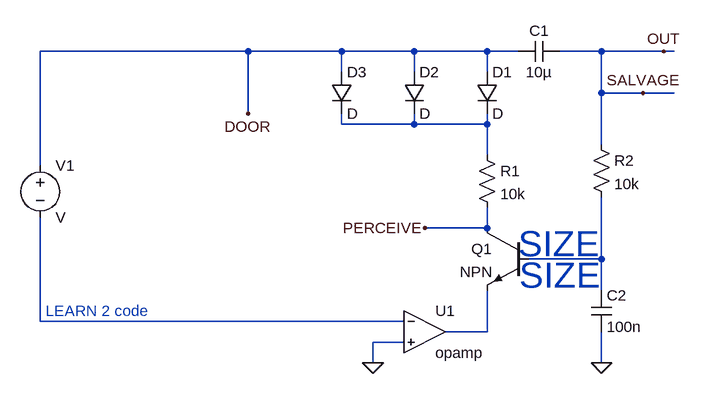
[diagram p0: schematic test.asc]
test.asc, the LTspice schematic file:
Version 4
SHEET 1 1812 680
WIRE 240 -560 -80 -560
WIRE 384 -560 240 -560
WIRE 496 -560 384 -560
WIRE 608 -560 496 -560
WIRE 656 -560 608 -560
WIRE 784 -560 720 -560
WIRE 880 -560 784 -560
WIRE 896 -560 880 -560
WIRE 384 -528 384 -560
WIRE 496 -528 496 -560
WIRE 608 -528 608 -560
WIRE 784 -496 784 -560
WIRE 848 -496 784 -496
WIRE 896 -496 848 -496
WIRE 240 -464 240 -560
WIRE 384 -448 384 -464
WIRE 496 -448 496 -464
WIRE 496 -448 384 -448
WIRE 608 -448 608 -464
WIRE 608 -448 496 -448
WIRE 784 -416 784 -496
WIRE 608 -400 608 -448
WIRE -80 -384 -80 -560
WIRE 608 -288 608 -320
WIRE 608 -288 512 -288
WIRE 784 -240 784 -336
WIRE 784 -240 672 -240
WIRE 784 -192 784 -240
WIRE -80 -144 -80 -304
WIRE 480 -144 -80 -144
WIRE 608 -128 608 -192
WIRE 608 -128 544 -128
WIRE 480 -112 432 -112
WIRE 432 -80 432 -112
WIRE 784 -80 784 -128
FLAG 432 -80 0
FLAG 784 -80 0
FLAG 880 -560 OUT
FLAG 848 -496 SALVAGE
FLAG 240 -464 DOOR
FLAG 512 -288 PERCEIVE
SYMBOL OpAmps\\opamp 512 -192 R0
SYMATTR InstName U1
SYMBOL npn 672 -288 M0
SYMATTR InstName Q1
SYMBOL res 592 -416 R0
SYMATTR InstName R1
SYMATTR Value 10k
SYMBOL diode 592 -528 R0
SYMATTR InstName D1
SYMBOL diode 480 -528 R0
SYMATTR InstName D2
SYMBOL diode 368 -528 R0
SYMATTR InstName D3
SYMBOL voltage -80 -400 R0
SYMATTR InstName V1
SYMBOL cap 720 -576 R90
WINDOW 0 0 32 VBottom 2
WINDOW 3 32 32 VTop 2
SYMATTR InstName C1
SYMATTR Value 10µ
SYMBOL cap 768 -192 R0
SYMATTR InstName C2
SYMATTR Value 100n
SYMBOL res 768 -432 R0
SYMATTR InstName R2
SYMATTR Value 10k
TEXT -72 -160 Left 2 ;LEARN 2 code
TEXT 656 -264 Left 5 ;SIZE
TEXT 720 -216 Center 5 ;SIZE

The netlist it stands for:
* test.asc
XU1 N003 0 N004 opamp Aol=100K GBW=10Meg  ; pins invin noninvin out
Q1 PERCEIVE N002 N004 0 NPN
R1 N001 PERCEIVE 10k
D1 DOOR N001 D
D2 DOOR N001 D
D3 DOOR N001 D
V1 DOOR N003 V
C1 SALVAGE DOOR 10µ
C2 N002 0 100n
R2 SALVAGE N002 10k
.model D D
.lib standard.dio
.model NPN NPN
.model PNP PNP
.lib standard.bjt
* LEARN 2 code
* SIZE
* SIZE
.backanno
.end